# Altium schematic sheet MainBoardV2.SchDoc
size A3
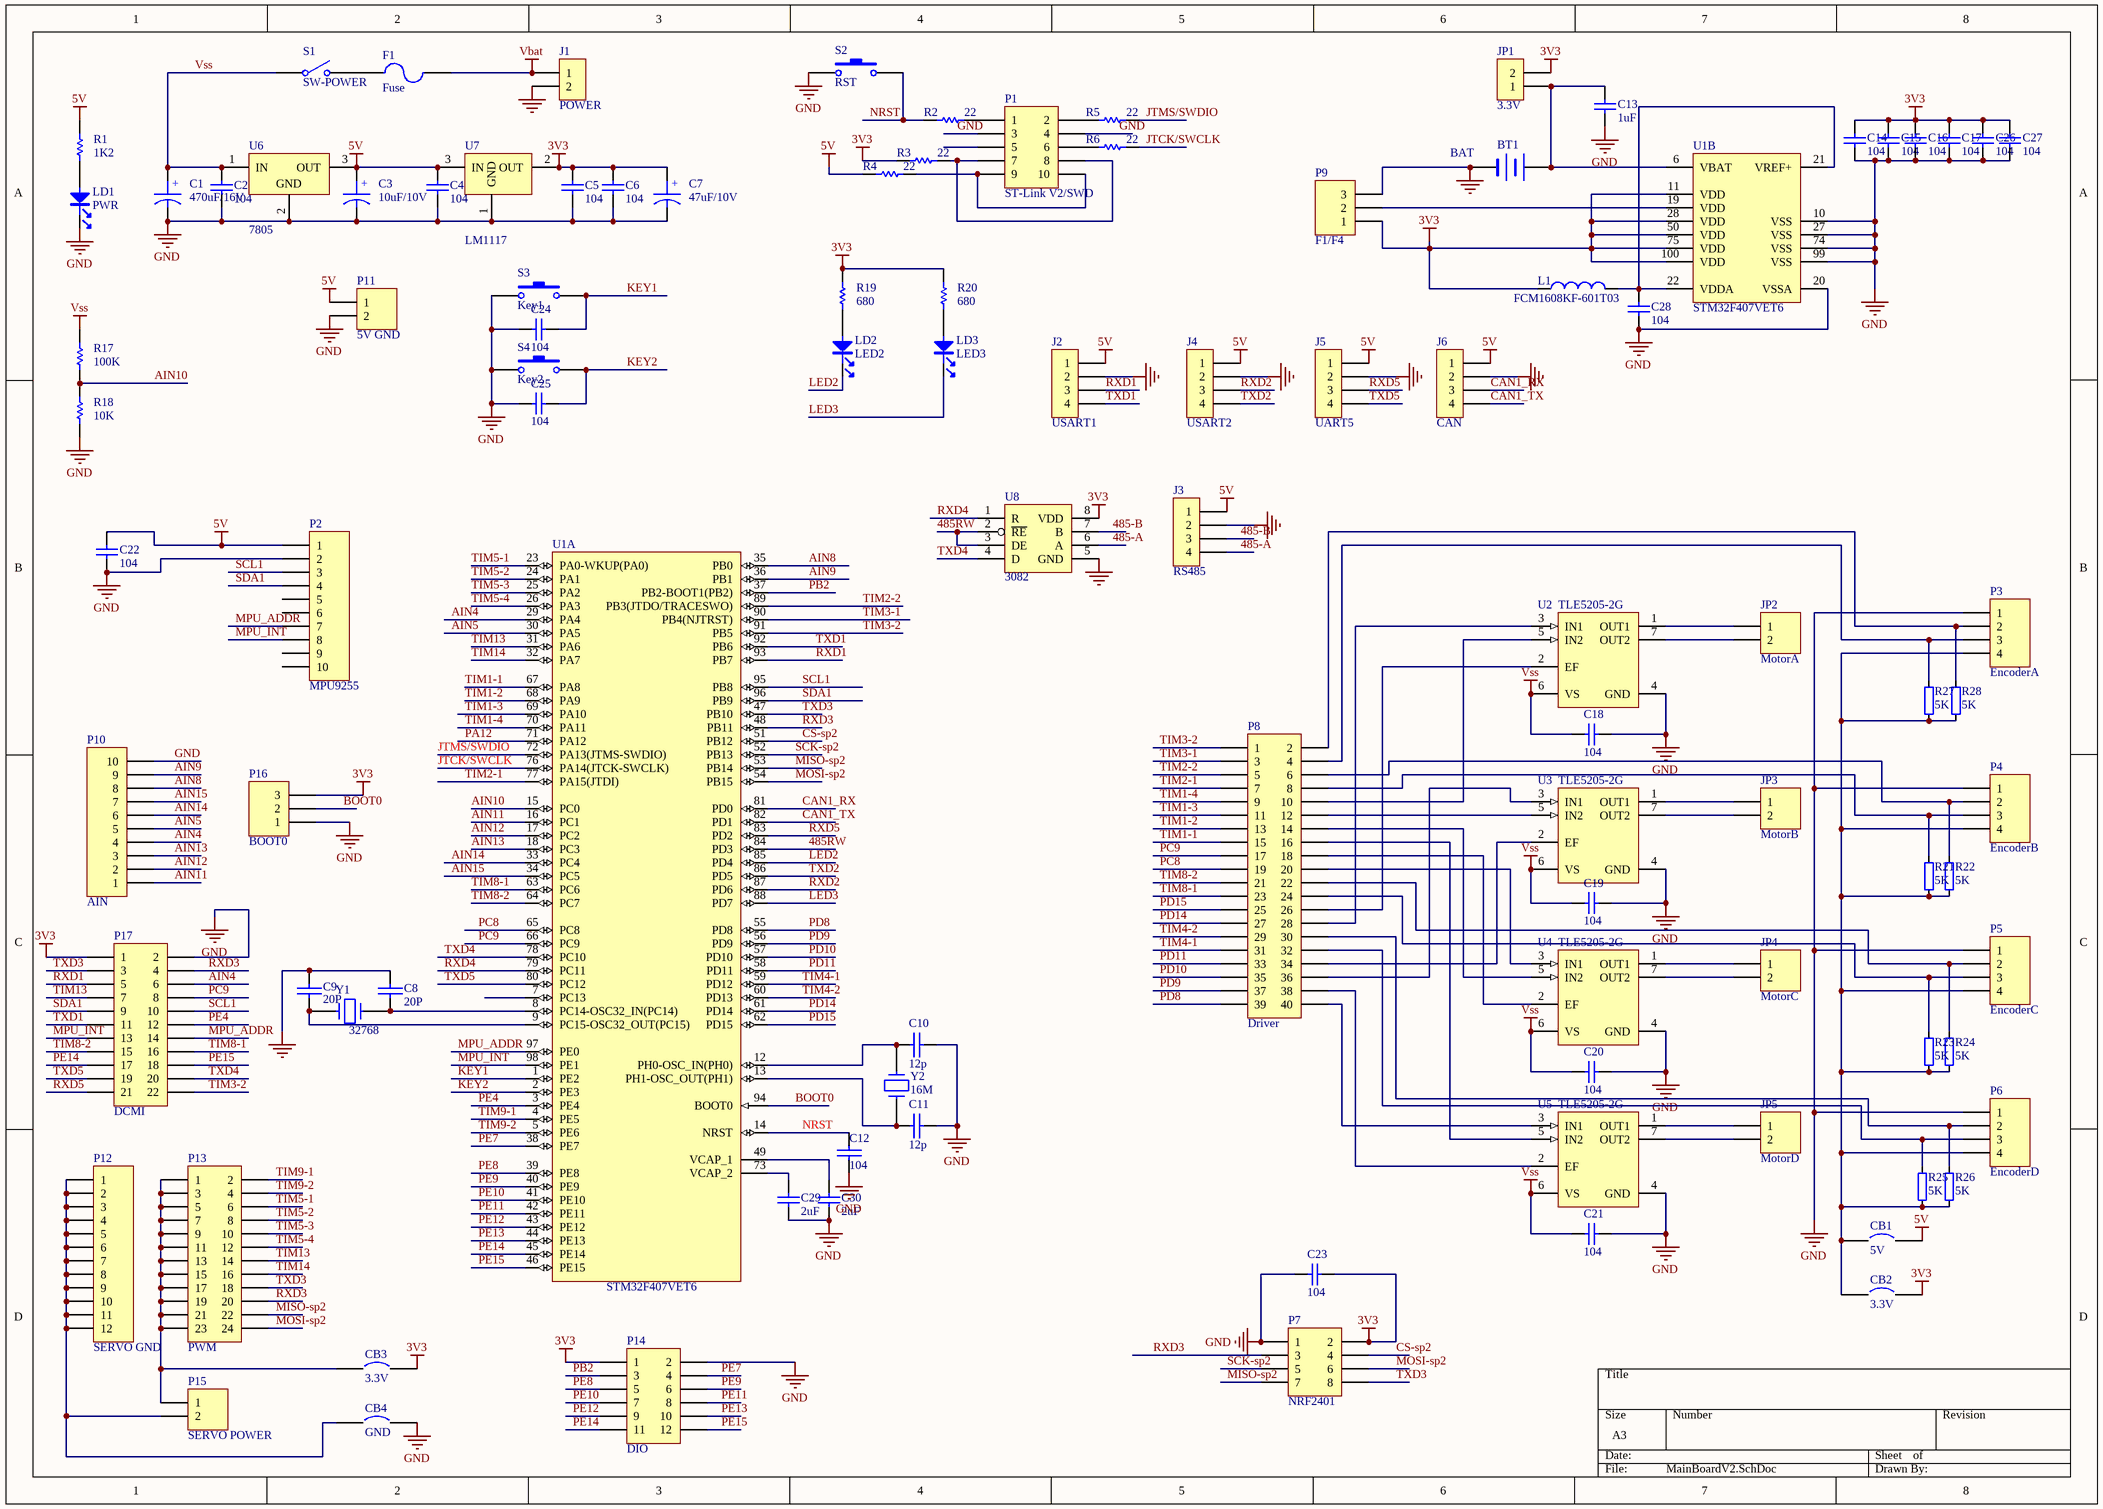
[diagram p0: MainBoardV2.SchDoc]

## Parts
BT1  BAT  [SIP2 - duplicate]
C1  470uF/16V  [RB2]
C2  value 104  [0603]  (hidden comment: Cap)
C3  10uF/10V  [RB2]
C4  value 104  [0603]  (hidden comment: Cap)
C5  value 104  [0603]  (hidden comment: Cap)
C6  value 104  [0603]  (hidden comment: Cap)
C7  47uF/10V  [RB2]
C8  20P  [0603]
C9  20P  [0603]
C10  12p  [0603]
C11  12p  [0603]
C12  value 104  [0603]
C13  value 1uF  [0603]  (hidden comment: Cap)
C14  value 104  [0603]  (hidden comment: Cap)
C15  value 104  [0603]  (hidden comment: Cap)
C16  value 104  [0603]  (hidden comment: Cap)
C17  value 104  [0603]  (hidden comment: Cap)
C18  value 104  [0603]  (hidden comment: Cap)
C19  value 104  [0603]  (hidden comment: Cap)
C20  value 104  [0603]  (hidden comment: Cap)
C21  value 104  [0603]  (hidden comment: Cap)
C22  value 104  [0603]  (hidden comment: Cap)
C23  value 104  [0603]  (hidden comment: Cap)
C24  value 104  [0603]  (hidden comment: Cap)
C25  value 104  [0603]  (hidden comment: Cap)
C26  value 104  [0603]  (hidden comment: Cap)
C27  value 104  [0603]  (hidden comment: Cap)
C28  value 104  [0603]  (hidden comment: Cap)
C29  value 2uF  [0603]  (hidden comment: Cap)
C30  value 2uF  [0603]  (hidden comment: Cap)
CB1  5V  [SIP2 - duplicate]
CB2  3.3V  [SIP2 - duplicate]
CB3  3.3V  [SIP2 - duplicate]
CB4  GND  [SIP2 - duplicate]
F1  Fuse  [1808Shell]
J1  POWER  [SIP2-200]
J2  USART1  [sip4]
J3  RS485  [sip4]
J4  USART2  [sip4]
J5  UART5  [sip4]
J6  CAN  [sip4]
JP1  3.3V  [SIP2 - duplicate]
JP2  MotorA  [SIP2-150]
JP3  MotorB  [SIP2-150]
JP4  MotorC  [SIP2-150]
JP5  MotorD  [SIP2-150]
L1  FCM1608KF-601T03  [0603]
LD1  PWR  [0603]
LD2  LED2  [0603]
LD3  LED3  [0603]
P1  ST-Link V2/SWD  [HDR2X5]
P2  MPU9255  [HDR1X10]
P3  EncoderA  [SIP4-150]
P4  EncoderB  [SIP4-150]
P5  EncoderC  [SIP4-150]
P6  EncoderD  [SIP4-150]
P7  NRF2401  [HDR2X4]
P8  Driver  [HDR2X20]
P9  F1/F4  [HDR1X3]
P10  AIN  [HDR1X10]
P11  5V GND  [SIP2-150]
P12  SERVO GND  [HDR1X12]
P13  PWM  [HDR2X12]
P14  DIO  [HDR2X6]
P15  SERVO POWER  [2p150]
P16  BOOT0  [HDR1X3]
P17  DCMI  [HDR2X11]
R1  1K2  [0603]
R2  22  [0603]
R3  22  [0603]
R4  22  [0603]
R5  22  [0603]
R6  22  [0603]
R17  100K  [0603]
R18  10K  [0603]
R19  680  [0603]
R20  680  [0603]
R21  5K  [0603]
R22  5K  [0603]
R23  5K  [0603]
R24  5K  [0603]
R25  5K  [0603]
R26  5K  [0603]
R27  5K  [0603]
R28  5K  [0603]
S1  SW-POWER  [SPST-2]
S2  RST  [key2]
S3  Key1  [key2]
S4  Key2  [key2]
U1  STM32F407VET6  [QUAD100]  (parts A,B of 2)
U2  TLE5205-2G  [INF-PG-TO263-7-1_L]
U3  TLE5205-2G  [INF-PG-TO263-7-1_L]
U4  TLE5205-2G  [INF-PG-TO263-7-1_L]
U5  TLE5205-2G  [INF-PG-TO263-7-1_L]
U6  7805  [ktt]
U7  LM1117  [SPP3]
U8  3082  [so-8]
Y1  32768  [sip2]
Y2  16M  [XTAL1]

## Nets
3V3: C5.2 C6.2 C7.1 C14.2 C15.2 C16.2 C17.2 C23.1 C26.2 C27.2 CB2.2 CB3.2 JP1.2 L1.1 P7.2 P9.1 P14.1 P16.3 P17.1 R3.1 R19.2 R20.2 U1.11(VDD) U1.28(VDD) U1.50(VDD) U1.75(VDD) U1.100(VDD) U7.2(OUT) U8.8(VDD)
5V: C3.1 C4.2 C22.1 CB1.2 J2.1 J3.1 J4.1 J5.1 J6.1 P2.1 P11.1 R1.2 R4.1 U6.3(OUT) U7.3(IN)
GND: BT1.2(-) C1.2 C2.1 C3.2 C4.1 C5.1 C6.1 C7.2 C8.1 C9.1 C10.2 C11.2 C12.2 C13.1 C14.1 C15.1 C16.1 C17.1 C18.1 C19.1 C20.1 C21.1 C22.2 C23.2 C24.1 C25.1 C26.1 C27.1 C28.1 C29.1 C30.1 CB4.2 J1.2 J2.2 J3.2 J4.2 J5.2 J6.2 LD1.2 P1.3 P1.4 P2.2 P3.1 P4.1 P5.1 P6.1 P7.1 P9.3 P10.10 P11.2 P14.2 P16.1 P17.2 R18.1 S2.1 S3.1 S4.1 U1.10(VSS) U1.20(VSSA) U1.27(VSS) U1.74(VSS) U1.99(VSS) U2.4(GND) U3.4(GND) U4.4(GND) U5.4(GND) U6.2(GND) U7.1(GND) U8.5(GND)
Vbat: F1.2 J1.1
Vss: C1.1 C2.2 C18.2 C19.2 C20.2 C21.2 R17.2 S1.1(COMMON) U2.6(VS) U3.6(VS) U4.6(VS) U5.6(VS) U6.1(IN)
485-A: J3.4 U8.6(A)
485-B: J3.3 U8.7(B)
485RW: U1.84(PD3) U8.2(~{RE}) U8.3(DE)
AIN4: P10.4 P17.6 U1.29(PA4)
AIN5: P10.5 U1.30(PA5)
AIN8: P10.8 U1.35(PB0)
AIN9: P10.9 U1.36(PB1)
AIN10: R17.1 R18.2 U1.15(PC0)
AIN11: P10.1 U1.16(PC1)
AIN12: P10.2 U1.17(PC2)
AIN13: P10.3 U1.18(PC3)
AIN14: P10.6 U1.33(PC4)
AIN15: P10.7 U1.34(PC5)
BOOT0: P16.2 U1.94(BOOT0)
CAN1_RX: J6.3 U1.81(PD0)
CAN1_TX: J6.4 U1.82(PD1)
CS-sp2: P7.4 U1.51(PB12)
JTCK/SWCLK: R6.2 U1.76(PA14(JTCK-SWCLK))
JTMS/SWDIO: R5.2 U1.72(PA13(JTMS-SWDIO))
KEY1: C24.2 S3.2 U1.1(PE2)
KEY2: C25.2 S4.2 U1.2(PE3)
LED2: LD2.2 U1.85(PD4)
LED3: LD3.2 U1.88(PD7)
MISO-sp2: P7.7 P13.22 U1.53(PB14)
MOSI-sp2: P7.6 P13.24 U1.54(PB15)
MPU_ADDR: P2.7 P17.14 U1.97(PE0)
MPU_INT: P2.8 P17.13 U1.98(PE1)
NRST: C12.1 R2.1 S2.2 U1.14(NRST)
PA12: U1.71(PA12)
PB2: P14.3 U1.37(PB2-BOOT1(PB2))
PC8: P8.19 U1.65(PC8)
PC9: P8.17 P17.8 U1.66(PC9)
PD8: P8.39 U1.55(PD8)
PD9: P8.37 U1.56(PD9)
PD10: P8.35 U1.57(PD10)
PD11: P8.33 U1.58(PD11)
PD14: P8.27 U1.61(PD14)
PD15: P8.25 U1.62(PD15)
PE4: P17.12 U1.3(PE4)
PE7: P14.4 U1.38(PE7)
PE8: P14.5 U1.39(PE8)
PE9: P14.6 U1.40(PE9)
PE10: P14.7 U1.41(PE10)
PE11: P14.8 U1.42(PE11)
PE12: P14.9 U1.43(PE12)
PE13: P14.10 U1.44(PE13)
PE14: P14.11 P17.17 U1.45(PE14)
PE15: P14.12 P17.18 U1.46(PE15)
RXD1: J2.3 P17.5 U1.93(PB7)
RXD2: J4.3 U1.87(PD6)
RXD3: P7.3 P13.20 P17.4 U1.48(PB11)
RXD4: U1.79(PC11) U8.1(R)
RXD5: J5.3 P17.21 U1.83(PD2)
SCK-sp2: P7.5 U1.52(PB13)
SCL1: P2.3 P17.10 U1.95(PB8)
SDA1: P2.4 P17.9 U1.96(PB9)
TIM1-1: P8.15 U1.67(PA8)
TIM1-2: P8.13 U1.68(PA9)
TIM1-3: P8.11 U1.69(PA10)
TIM1-4: P8.9 U1.70(PA11)
TIM2-1: P8.7 U1.77(PA15(JTDI))
TIM2-2: P8.5 U1.89(PB3(JTDO/TRACESWO))
TIM3-1: P8.3 U1.90(PB4(NJTRST))
TIM3-2: P8.1 P17.22 U1.91(PB5)
TIM4-1: P8.31 U1.59(PD12)
TIM4-2: P8.29 U1.60(PD13)
TIM5-1: P13.6 U1.23(PA0-WKUP(PA0))
TIM5-2: P13.8 U1.24(PA1)
TIM5-3: P13.10 U1.25(PA2)
TIM5-4: P13.12 U1.26(PA3)
TIM8-1: P8.23 P17.16 U1.63(PC6)
TIM8-2: P8.21 P17.15 U1.64(PC7)
TIM9-1: P13.2 U1.4(PE5)
TIM9-2: P13.4 U1.5(PE6)
TIM13: P13.14 P17.7 U1.31(PA6)
TIM14: P13.16 U1.32(PA7)
TXD1: J2.4 P17.11 U1.92(PB6)
TXD2: J4.4 U1.86(PD5)
TXD3: P7.8 P13.18 P17.3 U1.47(PB10)
TXD4: P17.20 U1.78(PC10) U8.4(D)
TXD5: J5.4 P17.19 U1.80(PC12)
NetBT1_1: BT1.1(+) C13.2 JP1.1 U1.6(VBAT)
NetC8_2: C8.2 U1.8(PC14-OSC32_IN(PC14)) Y1.2
NetC9_2: C9.2 U1.9(PC15-OSC32_OUT(PC15)) Y1.1
NetC10_1: C10.1 U1.12(PH0-OSC_IN(PH0)) Y2.2
NetC11_1: C11.1 U1.13(PH1-OSC_OUT(PH1)) Y2.1
NetC28_2: C28.2 L1.2 U1.21(VREF+) U1.22(VDDA)
NetC29_2: C29.2 U1.73(VCAP_2)
NetC30_2: C30.2 U1.49(VCAP_1)
NetCB1_1: CB1.1 CB2.1 P3.4 P4.4 P5.4 P6.4 R21.2 R22.2 R23.2 R24.2 R25.2 R26.2 R27.2 R28.2
NetCB3_1: CB3.1 P13.1 P13.3 P13.5 P13.7 P13.9 P13.11 P13.13 P13.15 P13.17 P13.19 P13.21 P13.23 P15.1
NetCB4_1: CB4.1 P12.1 P12.2 P12.3 P12.4 P12.5 P12.6 P12.7 P12.8 P12.9 P12.10 P12.11 P12.12 P15.2
NetF1_1: F1.1 S1.2(NO)
NetJP2_1: JP2.1 U2.1(OUT1)
NetJP2_2: JP2.2 U2.7(OUT2)
NetJP3_1: JP3.1 U3.1(OUT1)
NetJP3_2: JP3.2 U3.7(OUT2)
NetJP4_1: JP4.1 U4.1(OUT1)
NetJP4_2: JP4.2 U4.7(OUT2)
NetJP5_1: JP5.1 U5.1(OUT1)
NetJP5_2: JP5.2 U5.7(OUT2)
NetLD1_1: LD1.1 R1.1
NetLD2_1: LD2.1 R19.1
NetLD3_1: LD3.1 R20.1
NetP1_1: P1.1 R2.2
NetP1_2: P1.2 R5.1
NetP1_6: P1.6 R6.1
NetP1_7: P1.7 P1.8 R3.2
NetP1_9: P1.9 P1.10 R4.2
NetP3_2: P3.2 P8.2 R28.1
NetP3_3: P3.3 P8.4 R27.1
NetP4_2: P4.2 P8.6 R22.1
NetP4_3: P4.3 P8.8 R21.1
NetP5_2: P5.2 P8.22 R24.1
NetP5_3: P5.3 P8.24 R23.1
NetP6_2: P6.2 P8.30 R26.1
NetP6_3: P6.3 P8.32 R25.1
NetP8_10: P8.10 U2.5(IN2)
NetP8_12: P8.12 U3.5(IN2)
NetP8_14: P8.14 U4.5(IN2)
NetP8_16: P8.16 U5.5(IN2)
NetP8_18: P8.18 U4.2(EF)
NetP8_20: P8.20 U4.3(IN1)
NetP8_26: P8.26 U2.2(EF)
NetP8_28: P8.28 U2.3(IN1)
NetP8_34: P8.34 U3.2(EF)
NetP8_36: P8.36 U3.3(IN1)
NetP8_38: P8.38 U5.2(EF)
NetP8_40: P8.40 U5.3(IN1)
NetP9_2: P9.2 U1.19(VDD)

Not connected (* = marked no-connect by the designer): P1 5; P2 5 6 9 10; U1 7(PC13)

## Notes on the sheet
- (in symbol CAP POL) +

## Library data of the parts
BT1 = BATTERY
C1 C3 C7 = CAP POL: Text Field1: 20; Text Field2: 20
C2 C4-C6 C13-C30 = Cap: Capacitor; Published: 8-Jun-2000; LatestRevisionDate: 17-Jul-2002; LatestRevisionNote: Re-released for DXP Platform.; PackageReference: RAD-0.3; Publisher: Altium Limited; PackageDescription: Radial Cap, Thru-Hole; 2 Leads; 0.3 in Pin Spacing
C8-C12 = CAP: Capacitor
CB1-CB4 = Circuit Breaker: Published: 24-Mar-1999; LatestRevisionDate: 17-Jul-2002; LatestRevisionNote: Re-released for DXP Platform.; PackageReference: SPST-2; Publisher: Altium Limited; PackageDescription: Switch; 2 Leads
F1 = Fuse 2: Published: 8-Jun-2000; LatestRevisionDate: 17-Jul-2002; LatestRevisionNote: Re-released for DXP Platform.; PackageReference: PIN-W2/E2.8; Publisher: Altium Limited; PackageDescription: Thru-Hole; 2 Leads
J1 JP1 = CON2: Connector
J2-J6 = CON4: Connector
JP2-JP5 P11 P15 = Header 2: Header, 2-Pin; LatestRevisionDate: 17-Jul-2002; LatestRevisionNote: Re-released for DXP Platform.; Publisher: Altium Limited
L1 = Inductor: Value: 100uH; Published: 8-Jun-2000; Revision: July-2002: Re-released for DXP Platform.; Publisher: Altium Limited
LD1-LD3 = PHOTO
P1 = Header 5X2: Header, 5-Pin, Dual row; LatestRevisionDate: 17-Jul-2002; LatestRevisionNote: Re-released for DXP Platform.; Publisher: Altium Limited
P2 P10 = Header 10: Header, 10-Pin; LatestRevisionDate: 17-Jul-2002; LatestRevisionNote: Re-released for DXP Platform.; Publisher: Altium Limited
P3-P6 = Header 4: Header, 4-Pin; LatestRevisionDate: 17-Jul-2002; LatestRevisionNote: Re-released for DXP Platform.; Publisher: Altium Limited
P7 = Header 4X2: Header, 4-Pin, Dual row; LatestRevisionDate: 17-Jul-2002; LatestRevisionNote: Re-released for DXP Platform.; Publisher: Altium Limited
P8 = Header 20X2: Header, 20-Pin, Dual row; LatestRevisionDate: 17-Jul-2002; LatestRevisionNote: Re-released for DXP Platform.; Publisher: Altium Limited
P9 P16 = Header 3: Header, 3-Pin; LatestRevisionDate: 17-Jul-2002; LatestRevisionNote: Re-released for DXP Platform.; Publisher: Altium Limited
P12 = Header 12: Header, 12-Pin; LatestRevisionDate: 17-Jul-2002; LatestRevisionNote: Re-released for DXP Platform.; Publisher: Altium Limited
P13 = Header 12X2: Header, 12-Pin, Dual row; LatestRevisionDate: 17-Jul-2002; LatestRevisionNote: Re-released for DXP Platform.; Publisher: Altium Limited
P14 = Header 6X2: Header, 6-Pin, Dual row; LatestRevisionDate: 17-Jul-2002; LatestRevisionNote: Re-released for DXP Platform.; Publisher: Altium Limited
P17 = Header 11X2: Header, 11-Pin, Dual row; LatestRevisionDate: 17-Jul-2002; LatestRevisionNote: Re-released for DXP Platform.; Publisher: Altium Limited
R1-R6 R17 R19 R20 = Resistor_ST: Resistor 0402 / 0603 / 0805; Value: 10K
R18 = Resistor_ST: Resistor 0402 / 0603 / 0805; Value: 10K
R21-R28 = RES
S1 = SW-SPST: Single-Pole, Single-Throw Switch; Published: 24-Mar-1999; LatestRevisionDate: 17-Jul-2002; LatestRevisionNote: Re-released for DXP Platform.; PackageReference: SPST-2; Publisher: Altium Limited; PackageDescription: Switch; 2 Leads
S2-S4 = SW-PB: Switch; Published: 24-Mar-1999; LatestRevisionDate: 17-Jul-2002; LatestRevisionNote: Re-released for DXP Platform.; PackageReference: SPST-2; Publisher: Altium Limited; PackageDescription: Switch; 2 Leads
U1 = STM32F407VET6: ARM Cortex-M4 32-bit MCU+FPU, 210 DMIPS, 512 kB Flash, 192 kB Internal RAM, 82 I/Os, 100-pin LQFP, -40 to 85 degC, Tray; Manufacturer: STMicroelectronics; D/A Converter: 2x12-bit; FLASH Size (Prog) (kB): 512; I/Os (High Current): 82; Internal RAM Size (kB): 192; Operating Frequency(F) (Processor speed) (MHz): 168; Supply Voltage(Vcc) max (V): 3.6; Supply Voltage(Vcc) min (V): 1.8; DatasheetVersion: Rev. 4; PackageVersion: Rev. 1, 06/2013; PackageReference: LQFP100; PackageDescription: 100-Pin Low Profile Quad Flat Package, 14 x 14 mm Body, 0.5 mm Pitch; Supplier 1: Digi-Key; Supplier Part Number 1: 497-12075-ND; Supplier 2: Farnell; Supplier Part Number 2: 2064367; Supplier 3: Newark; Supplier Part Number 3: 73T2332; Supplier 4: Mouser; Supplier Part Number 4: 511-STM32F407VET6; Core: ARM Cortex-M4; Packing: Tray; Mounting Technology: Surface Mount; PartNumber: STM32F407VET6; ComponentLink1Description: Manufacturer URL; ComponentLink1URL: http://www.st.com/web/en/home.html; ComponentLink2Description: Datasheet; ComponentLink2URL: http://www.st.com/st-web-ui/static/active/en/resource/technical/document/datasheet/DM00037051.pdf; ComponentLink3Description: Package Specification; ComponentLink3URL: http://www.st.com/st-web-ui/static/active/en/resource/technical/document/data_brief/DM00071938.pdf
U2-U5 = TLE5205-2G: 5 A H-Bridge for DC-Motor Applications, 6 to 40 V, 220 mOhm RDS(on), PG-TO263-7-1, Reel, Green; Manufacturer: Infineon; Current Limit (min.): 6 A; Green: TRUE; Operating Range: 6 to 40 V; Quiescent Current (max.): 10 mA; RthJC (max): 3 K/W; DatasheetVersion: Rev. 1.1; PackageVersion: May-07; PackageReference: PG-TO263-7-1; PackageDescription: 7-Pin Plastic (Green) Transistor Single Outline Package, 9.25 x 10 mm Body, 1.27 mm Pitch; Supplier 1: Digi-Key; Supplier Part Number 1: TLE5205-2GINTR-ND; Supplier 2: Digi-Key; Supplier Part Number 2: TLE5205-2GINCT-ND; Supplier 3: Digi-Key; Supplier Part Number 3: TLE5205-2GINDKR-ND; Supplier 4: Mouser; Supplier Part Number 4: 726-TLE52052G; Halogen-free: TRUE; Packing: Reel; RDS (on) (typ./switch): 220 mOhm; Mounting Technology: Surface Mount; PartNumber: TLE5205-2G; ComponentLink1Description: Manufacturer URL; ComponentLink1URL: http://www.infineon.com/; ComponentLink2Description: Datasheet; ComponentLink2URL: http://www.infineon.com/dgdl/TLE5205-2_DS_11%5B1%5D.pdf?folderId=db3a30431b3e89eb011bb632994f065b&fileId=db3a30431f848401011fc747c7a0797f&location=en.Products.Automotive_ICs.Powertrain_ICs.Powertrain_H-Bridges_for_Electronic_Throttle_Control.DATASHEET.TLE5205-2_DS_11[1].pdf; ComponentLink3Description: Package Specification; ComponentLink3URL: http://www.infineon.com/dgdl/TLE5205-2_DS_11%5B1%5D.pdf?folderId=db3a30431b3e89eb011bb632994f065b&fileId=db3a30431f848401011fc747c7a0797f&sId=db3a30433d68e984013d7d43135b5b6a
U6 = LM330KC: 3-Terminal Positive Regulator; Note: Pin 2 is electrically connected to tab; Published: 15-Apr-2002; DatasheetVersion: Apr-1988; PackageVersion: Sep-1995; PackageReference: KC03; Publisher: Altium Limited; PackageDescription: TO, Thru-Hole, Vertical, Heatsink Mounted; 3 In-Line Leads; Pitch 2.54 mm; ComponentLink1Description: Manufacturer Link; ComponentLink1URL: http://www.ti.com/
U8 = 75176
Y1 Y2 = CRYSTAL